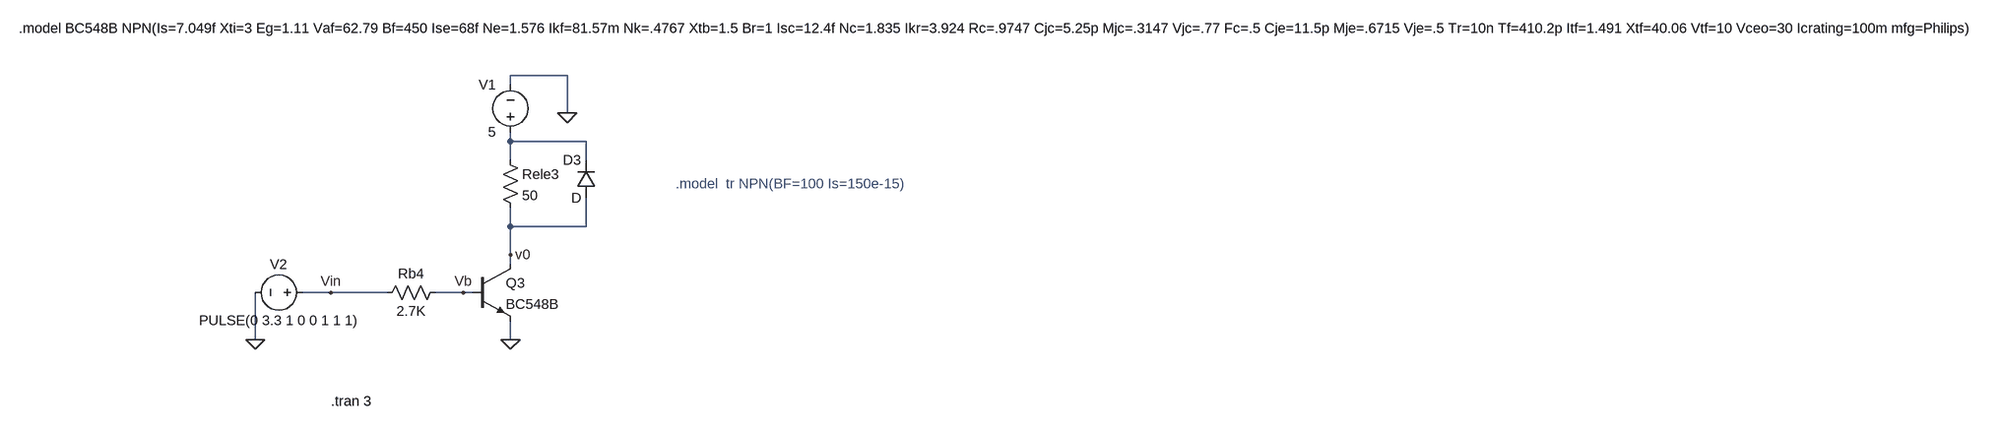
[diagram p0: schematic Trabajo Grupal(1).asc]
Trabajo Grupal(1).asc, the LTspice schematic file:
Version 4
SHEET 1 3136 680
WIRE 320 -224 224 -224
WIRE 224 -208 224 -224
WIRE 320 -160 320 -224
WIRE 224 -112 224 -128
WIRE 352 -112 224 -112
WIRE 224 -80 224 -112
WIRE 352 -80 352 -112
WIRE 224 32 224 0
WIRE 352 32 352 -16
WIRE 352 32 224 32
WIRE 224 80 224 32
WIRE 224 96 224 80
WIRE -80 144 -128 144
WIRE 16 144 -80 144
WIRE 144 144 96 144
WIRE 160 144 144 144
WIRE -208 224 -208 144
WIRE 224 224 224 192
FLAG 224 224 0
FLAG 320 -160 0
FLAG -208 224 0
FLAG 224 80 v0
FLAG 144 144 Vb
FLAG -80 144 Vin
SYMBOL voltage 224 -112 R180
WINDOW 0 24 96 Left 2
WINDOW 3 24 16 Left 2
WINDOW 123 0 0 Left 0
WINDOW 39 0 0 Left 0
SYMATTR InstName V1
SYMATTR Value 5
SYMBOL res 0 160 R270
WINDOW 0 32 56 VTop 2
WINDOW 3 0 56 VBottom 2
SYMATTR InstName Rb4
SYMATTR Value 2.7K
SYMBOL voltage -112 144 R90
WINDOW 0 -32 56 VBottom 2
WINDOW 3 32 56 VTop 2
WINDOW 123 0 0 Left 0
WINDOW 39 0 0 Left 0
SYMATTR InstName V2
SYMATTR Value PULSE(0 3.3 1 0 0 1 1 1)
SYMBOL diode 368 -16 R180
WINDOW 0 24 64 Left 2
WINDOW 3 24 0 Left 2
SYMATTR InstName D3
SYMBOL res 208 -96 R0
SYMATTR InstName Rele3
SYMATTR Value 50
SYMBOL npn 160 96 R0
SYMATTR InstName Q3
SYMATTR Value BC548B
TEXT -80 328 Left 2 !.tran 3
TEXT 504 -40 Left 2 ;.model  tr NPN(BF=100 Is=150e-15)
TEXT -608 -304 Left 2 !.model BC548B NPN(Is=7.049f Xti=3 Eg=1.11 Vaf=62.79 Bf=450 Ise=68f Ne=1.576 Ikf=81.57m Nk=.4767 Xtb=1.5 Br=1 Isc=12.4f Nc=1.835 Ikr=3.924 Rc=.9747 Cjc=5.25p Mjc=.3147 Vjc=.77 Fc=.5 Cje=11.5p Mje=.6715 Vje=.5 Tr=10n Tf=410.2p Itf=1.491 Xtf=40.06 Vtf=10 Vceo=30 Icrating=100m mfg=Philips)

The netlist it stands for:
* Trabajo Grupal(1).asc
V1 N001 0 5
Rb4 Vin Vb 2.7K
V2 Vin 0 PULSE(0 3.3 1 0 0 1 1 1)
D3 v0 N001 D
Rele3 N001 v0 50
Q3 v0 Vb 0 0 BC548B
.model D D
.lib standard.dio
.model NPN NPN
.model PNP PNP
.lib standard.bjt
.tran 3
* .model  tr NPN(BF=100 Is=150e-15)
.model BC548B NPN(Is=7.049f Xti=3 Eg=1.11 Vaf=62.79 Bf=450 Ise=68f Ne=1.576 Ikf=81.57m Nk=.4767 Xtb=1.5 Br=1 Isc=12.4f Nc=1.835 Ikr=3.924 Rc=.9747 Cjc=5.25p Mjc=.3147 Vjc=.77 Fc=.5 Cje=11.5p Mje=.6715 Vje=.5 Tr=10n Tf=410.2p Itf=1.491 Xtf=40.06 Vtf=10 Vceo=30 Icrating=100m mfg=Philips)
.backanno
.end